# Altium project MB997.PrjPCB
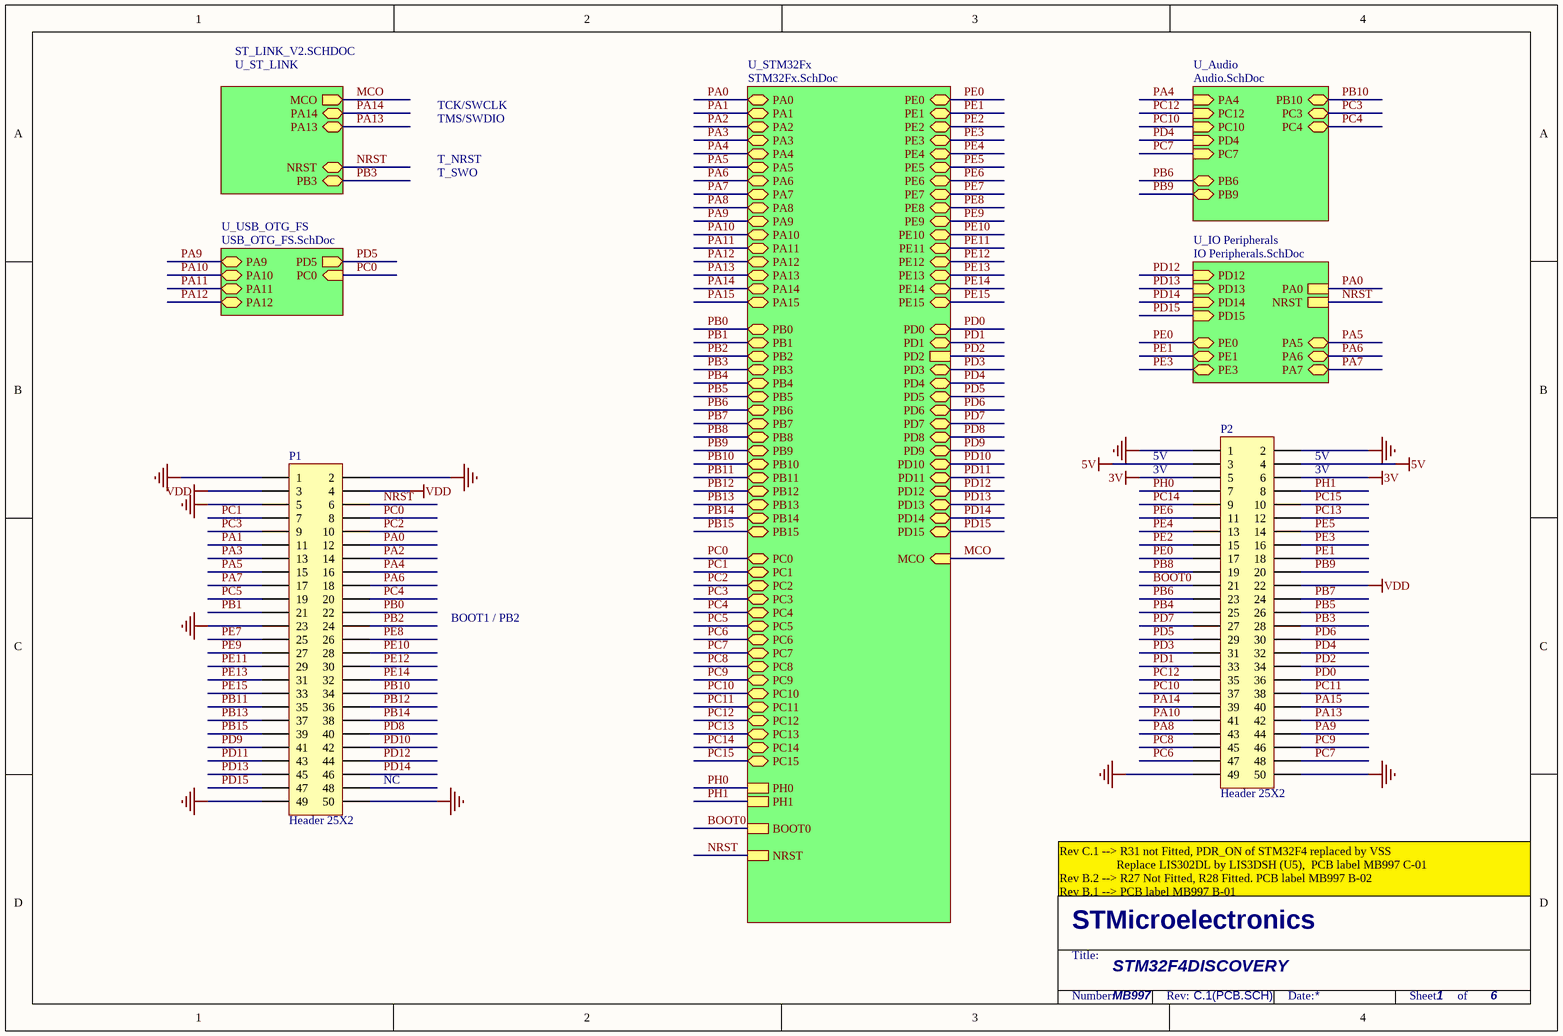
[diagram p0: MB997.SchDoc]
6 sheets, 187 parts. Net scope: hierarchical (ports join the sheet entries above them; power ports are global).
Sheets:
  MB997.SchDoc
    U_ST_LINK = ST_LINK_V2.SCHDOC
    U_Audio = Audio.SchDoc
    U_IO Peripherals = IO Peripherals.SchDoc
    U_STM32Fx = STM32Fx.SchDoc
    U_USB_OTG_FS = USB_OTG_FS.SchDoc

## Sheet MB997.SchDoc
size A4; DocumentNumber: 1; Revision: C.1(PCB.SCH); SheetNumber: 1; SheetTotal: 6; PageSetup: Record=PageOptions|CenterHorizontal=True|CenterVertical=True|PrintScale=1.00|XCorrection=1.00|YCorrection=1.00|PrintKind=1|BorderSize=5000000|LeftOffset=0|BottomOffset=0|Orientation=2|PaperLength=1000|PaperWidth=1000|Scale=100|PaperSource=15|PrintQuality=1200|MediaType=1|DitherType=10|PaperKind=A4|PrintScaleMode=1

### Parts
P1  Header 25X2  [HDR2X25]
P2  Header 25X2  [HDR2X25]

### Sub-sheets
U_Audio = Audio.SchDoc: PA4 (in), PC12 (in), PC10 (in), PB6 (bidir), PB9 (bidir), PD4 (in), PC7 (in), PC3, PB10, PC4
U_IO Peripherals = IO Peripherals.SchDoc: PA0, NRST, PD12 (in), PE0, PD13 (in), PD14 (in), PD15 (in), PE1, PA5 (bidir), PA7 (bidir), PE3, PA6 (bidir)
U_ST_LINK = ST_LINK_V2.SCHDOC: PA13, PA14, NRST, PB3, MCO (out)
U_STM32Fx = STM32Fx.SchDoc: PA13 (bidir), PA14 (bidir), PA15 (bidir), PA12 (bidir), PA0 (bidir), PA1 (bidir), PA2 (bidir), PA3 (bidir), PA4 (bidir), PA5 (bidir), PA6 (bidir), PA7 (bidir), PA8 (bidir), PA9 (bidir), PA10 (bidir), PA11 (bidir), PB12 (bidir), PB0 (bidir), PB1 (bidir), PB2 (bidir), PB3 (bidir), PB4 (bidir), PB5 (bidir), PB6 (bidir), PB7 (bidir), PB8 (bidir), PB9 (bidir), PB10 (bidir), PB11 (bidir), PB13 (bidir), PB14 (bidir), PB15 (bidir), PC3 (bidir), PC15 (bidir), PC14 (bidir), PC13 (bidir), PC12 (bidir), PC11 (bidir), PC10 (bidir), PC9 (bidir), PC8 (bidir), PC7 (bidir), PC6 (bidir), PC5 (bidir), PC4 (bidir), PC2 (bidir), PC1 (bidir), PC0 (bidir), PD2, BOOT0, PH1, PH0, NRST, MCO (in), PE0, PE1, PE2, PE3, PE4, PE5, PE6, PE7, PE8, PE9, PE10, PE11, PE12, PE13, PE14, PE15, PD0, PD1, PD3, PD4, PD5, PD6, PD7, PD8, PD9, PD10, PD11, PD12, PD13, PD14, PD15
U_USB_OTG_FS = USB_OTG_FS.SchDoc: PD5 (out), PA11 (bidir), PA12 (bidir), PC0 (in), PA10 (bidir), PA9 (bidir)

### Nets
3V: P2.5 P2.6
5V: P2.3 P2.4
GND: P1.1 P1.2 P1.5 P1.23 P1.49 P1.50 P2.1 P2.2 P2.49 P2.50
VDD: P1.3 P1.4 P2.22
BOOT0: P2.21 ; sheet U_STM32Fx/BOOT0
MCO: sheet U_ST_LINK/MCO, sheet U_STM32Fx/MCO
NRST: P1.6 ; sheet U_ST_LINK/NRST, sheet U_IO Peripherals/NRST, sheet U_STM32Fx/NRST
PA0: P1.12 ; sheet U_IO Peripherals/PA0, sheet U_STM32Fx/PA0
PA1: P1.11 ; sheet U_STM32Fx/PA1
PA2: P1.14 ; sheet U_STM32Fx/PA2
PA3: P1.13 ; sheet U_STM32Fx/PA3
PA4: P1.16 ; sheet U_Audio/PA4, sheet U_STM32Fx/PA4
PA5: P1.15 ; sheet U_IO Peripherals/PA5, sheet U_STM32Fx/PA5
PA6: P1.18 ; sheet U_IO Peripherals/PA6, sheet U_STM32Fx/PA6
PA7: P1.17 ; sheet U_IO Peripherals/PA7, sheet U_STM32Fx/PA7
PA8: P2.43 ; sheet U_STM32Fx/PA8
PA9: P2.44 ; sheet U_STM32Fx/PA9, sheet U_USB_OTG_FS/PA9
PA10: P2.41 ; sheet U_STM32Fx/PA10, sheet U_USB_OTG_FS/PA10
PA11: sheet U_STM32Fx/PA11, sheet U_USB_OTG_FS/PA11
PA12: sheet U_STM32Fx/PA12, sheet U_USB_OTG_FS/PA12
PA13: P2.42 ; sheet U_ST_LINK/PA13, sheet U_STM32Fx/PA13
PA14: P2.39 ; sheet U_ST_LINK/PA14, sheet U_STM32Fx/PA14
PA15: P2.40 ; sheet U_STM32Fx/PA15
PB0: P1.22 ; sheet U_STM32Fx/PB0
PB1: P1.21 ; sheet U_STM32Fx/PB1
PB2: P1.24 ; sheet U_STM32Fx/PB2
PB3: P2.28 ; sheet U_ST_LINK/PB3, sheet U_STM32Fx/PB3
PB4: P2.25 ; sheet U_STM32Fx/PB4
PB5: P2.26 ; sheet U_STM32Fx/PB5
PB6: P2.23 ; sheet U_Audio/PB6, sheet U_STM32Fx/PB6
PB7: P2.24 ; sheet U_STM32Fx/PB7
PB8: P2.19 ; sheet U_STM32Fx/PB8
PB9: P2.20 ; sheet U_Audio/PB9, sheet U_STM32Fx/PB9
PB10: P1.34 ; sheet U_Audio/PB10, sheet U_STM32Fx/PB10
PB11: P1.35 ; sheet U_STM32Fx/PB11
PB12: P1.36 ; sheet U_STM32Fx/PB12
PB13: P1.37 ; sheet U_STM32Fx/PB13
PB14: P1.38 ; sheet U_STM32Fx/PB14
PB15: P1.39 ; sheet U_STM32Fx/PB15
PC0: P1.8 ; sheet U_STM32Fx/PC0, sheet U_USB_OTG_FS/PC0
PC1: P1.7 ; sheet U_STM32Fx/PC1
PC2: P1.10 ; sheet U_STM32Fx/PC2
PC3: P1.9 ; sheet U_Audio/PC3, sheet U_STM32Fx/PC3
PC4: P1.20 ; sheet U_Audio/PC4, sheet U_STM32Fx/PC4
PC5: P1.19 ; sheet U_STM32Fx/PC5
PC6: P2.47 ; sheet U_STM32Fx/PC6
PC7: P2.48 ; sheet U_Audio/PC7, sheet U_STM32Fx/PC7
PC8: P2.45 ; sheet U_STM32Fx/PC8
PC9: P2.46 ; sheet U_STM32Fx/PC9
PC10: P2.37 ; sheet U_Audio/PC10, sheet U_STM32Fx/PC10
PC11: P2.38 ; sheet U_STM32Fx/PC11
PC12: P2.35 ; sheet U_Audio/PC12, sheet U_STM32Fx/PC12
PC13: P2.12 ; sheet U_STM32Fx/PC13
PC14: P2.9 ; sheet U_STM32Fx/PC14
PC15: P2.10 ; sheet U_STM32Fx/PC15
PD0: P2.36 ; sheet U_STM32Fx/PD0
PD1: P2.33 ; sheet U_STM32Fx/PD1
PD2: P2.34 ; sheet U_STM32Fx/PD2
PD3: P2.31 ; sheet U_STM32Fx/PD3
PD4: P2.32 ; sheet U_Audio/PD4, sheet U_STM32Fx/PD4
PD5: P2.29 ; sheet U_STM32Fx/PD5, sheet U_USB_OTG_FS/PD5
PD6: P2.30 ; sheet U_STM32Fx/PD6
PD7: P2.27 ; sheet U_STM32Fx/PD7
PD8: P1.40 ; sheet U_STM32Fx/PD8
PD9: P1.41 ; sheet U_STM32Fx/PD9
PD10: P1.42 ; sheet U_STM32Fx/PD10
PD11: P1.43 ; sheet U_STM32Fx/PD11
PD12: P1.44 ; sheet U_IO Peripherals/PD12, sheet U_STM32Fx/PD12
PD13: P1.45 ; sheet U_IO Peripherals/PD13, sheet U_STM32Fx/PD13
PD14: P1.46 ; sheet U_IO Peripherals/PD14, sheet U_STM32Fx/PD14
PD15: P1.47 ; sheet U_IO Peripherals/PD15, sheet U_STM32Fx/PD15
PE0: P2.17 ; sheet U_IO Peripherals/PE0, sheet U_STM32Fx/PE0
PE1: P2.18 ; sheet U_IO Peripherals/PE1, sheet U_STM32Fx/PE1
PE2: P2.15 ; sheet U_STM32Fx/PE2
PE3: P2.16 ; sheet U_IO Peripherals/PE3, sheet U_STM32Fx/PE3
PE4: P2.13 ; sheet U_STM32Fx/PE4
PE5: P2.14 ; sheet U_STM32Fx/PE5
PE6: P2.11 ; sheet U_STM32Fx/PE6
PE7: P1.25 ; sheet U_STM32Fx/PE7
PE8: P1.26 ; sheet U_STM32Fx/PE8
PE9: P1.27 ; sheet U_STM32Fx/PE9
PE10: P1.28 ; sheet U_STM32Fx/PE10
PE11: P1.29 ; sheet U_STM32Fx/PE11
PE12: P1.30 ; sheet U_STM32Fx/PE12
PE13: P1.31 ; sheet U_STM32Fx/PE13
PE14: P1.32 ; sheet U_STM32Fx/PE14
PE15: P1.33 ; sheet U_STM32Fx/PE15
PH0: P2.7 ; sheet U_STM32Fx/PH0
PH1: P2.8 ; sheet U_STM32Fx/PH1

Not connected (* = marked no-connect by the designer): P1 48

### Notes on the sheet
- TCK/SWCLK
- TMS/SWDIO
- T_SWO
- T_NRST
- 5V
- 3V
- (near P2) 5V
- (near P2) 3V
- BOOT1 / PB2
- (near P1) NC
- Rev C.1 --> R31 not Fitted, PDR_ON of STM32F4 replaced by VSS
  Replace LIS302DL by LIS3DSH (U5),  PCB label MB997 C-01
  Rev B.2 --> R27 Not Fitted, R28 Fitted. PCB label MB997 B-02
  Rev B.1 --> PCB label MB997 B-01
- STM32F4DISCOVERY
- MB997
- 1
- STMicroelectronics
- Title:
- Number:
- Rev:
- Date:
- Sheet       of

### Library data of the parts
P1 P2 = Header 25X2: Header, 25-Pin, Dual row; LatestRevisionDate: 17-Jul-2002; LatestRevisionNote: Re-released for DXP Platform.; Publisher: Altium Limited

## Sheet ST_LINK_V2.SCHDOC
size A4; DocumentNumber: 2; Revision: C.1(PCB.SCH); SheetNumber: 2; SheetTotal: 6
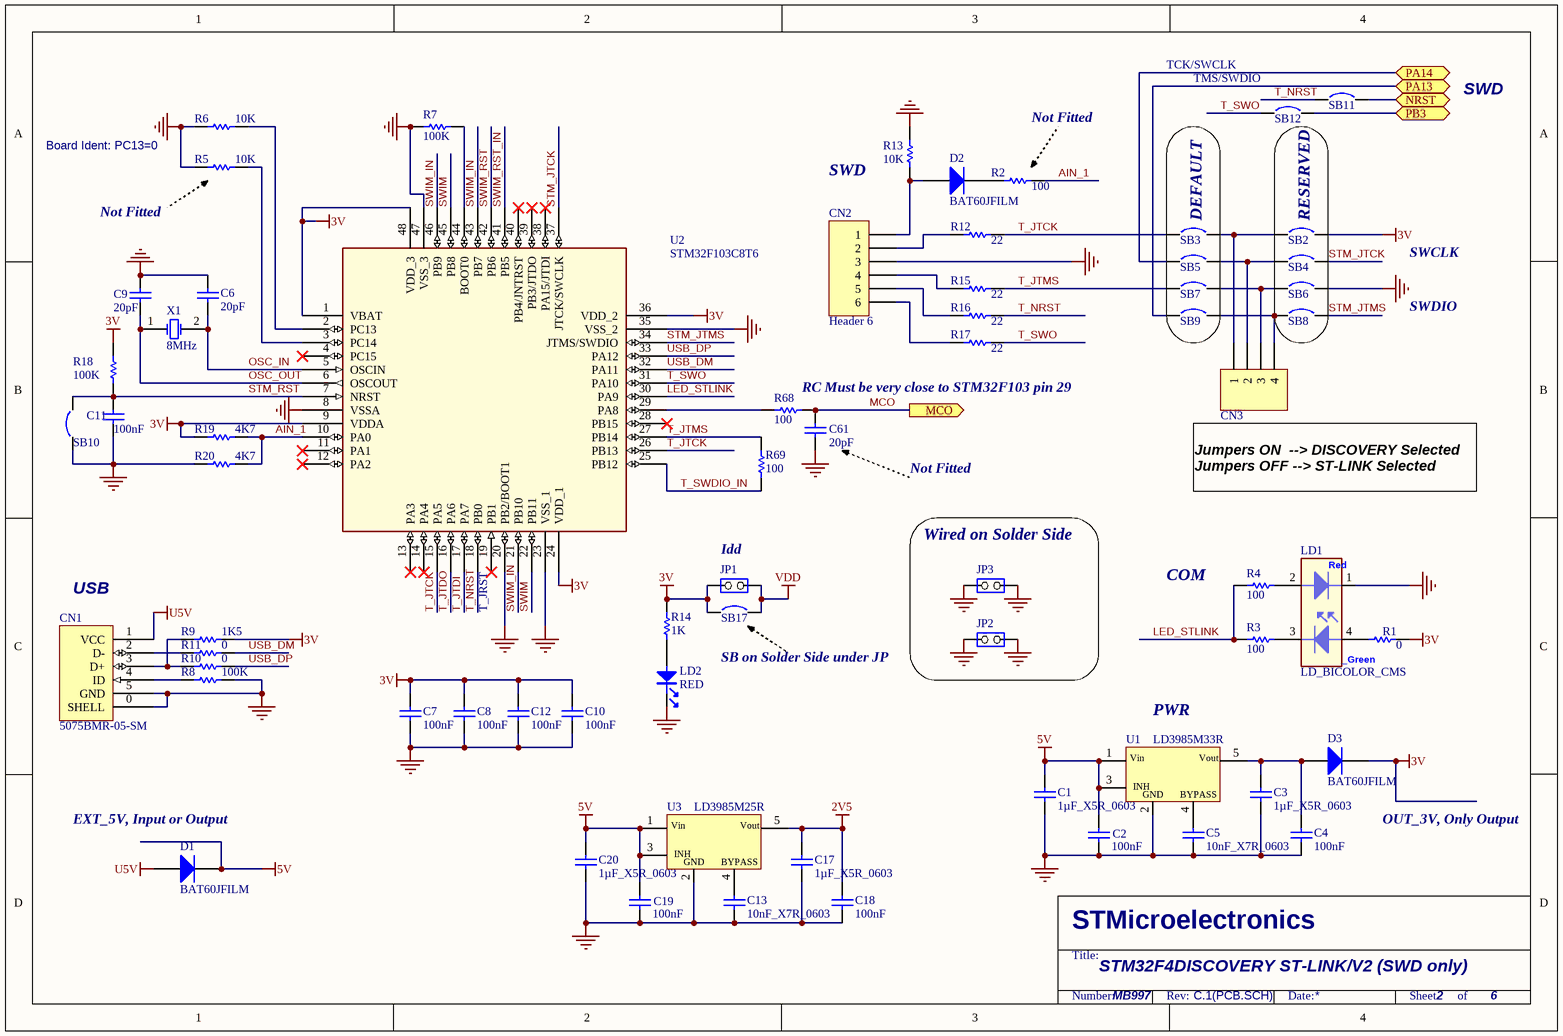
[diagram p1: ST_LINK_V2.SCHDOC]

### Parts
C1  1µF_X5R_0603  [0603C]
C2  100nF  [0603C]
C3  1µF_X5R_0603  [0603C]
C4  100nF  [0603C]
C5  10nF_X7R_0603  [0603C]
C6  20pF  [0402C]
C7  100nF  [0402C]
C8  100nF  [0402C]
C9  20pF  [0402C]
C10  100nF  [0402C]
C11  100nF  [0402C]
C12  100nF  [0402C]
C13  10nF_X7R_0603  [0603C]
C17  1µF_X5R_0603  [0603C]
C18  100nF  [0603C]
C19  100nF  [0603C]
C20  1µF_X5R_0603  [0603C]
C61  20pF  [0402C]
CN1  5075BMR-05-SM  [USB-MINI-B-SMD]
CN2  Header 6  [HDR1X6]
CN3  Header 4  [Header 4]  (value not drawn)
D1  BAT60JFILM  [SOD323/A]
D2  BAT60JFILM  [SOD323/A]
D3  BAT60JFILM  [SOD323/A]
JP1  (no value)  [SIP2/2.54]
JP2  (no value)  [SIP2/2.54]
JP3  (no value)  [SIP2/2.54]
LD1  LD_BICOLOR_CMS  [HSMF-A201]
LD2  RED  [0603D]
R1  0  [0402R]
R2  100  [0402R]
R3  100  [0402R]
R4  100  [0402R]
R5  10K  [0402R]
R6  10K  [0402R]
R7  100K  [0402R]
R8  100K  [0402R]
R9  1K5  [0402R]
R10  0  [0603R]
R11  0  [0603R]
R12  22  [0402R]
R13  10K  [0402R]
R14  1K  [0402R]
R15  22  [0402R]
R16  22  [0402R]
R17  22  [0402R]
R18  100K  [0402R]
R19  4K7  [0402R]
R20  4K7  [0402R]
R68  100  [0402R]
R69  100  [0402R]
SB2  Circuit Breaker  [JP2_SMD]  (value not drawn)
SB3  Circuit Breaker  [JP2_SMD]  (value not drawn)
SB4  Circuit Breaker  [JP2_SMD]  (value not drawn)
SB5  Circuit Breaker  [JP2_SMD]  (value not drawn)
SB6  Circuit Breaker  [JP2_SMD]  (value not drawn)
SB7  Circuit Breaker  [JP2_SMD]  (value not drawn)
SB8  Circuit Breaker  [JP2_SMD]  (value not drawn)
SB9  Circuit Breaker  [JP2_SMD]  (value not drawn)
SB10  Circuit Breaker  [JP2_SMD]  (value not drawn)
SB11  Circuit Breaker  [JP2_SMD]  (value not drawn)
SB12  Circuit Breaker  [JP2_SMD]  (value not drawn)
SB17  Circuit Breaker  [JP2_SMD]  (value not drawn)
U1  LD3985M33R  [SOT-23-5L]
U2  STM32F103C8T6  [QFP48 7X7]
U3  LD3985M25R  [SOT-23-5L]
X1  8MHz  [XTAL1]

### Blocks framed on the sheet
DEFAULT: SB3 SB5 SB7 SB9
RESERVED: SB2 SB4 SB6 SB8
Wired on Solder Side: JP2 JP3

### Ports
MCO (out), NRST, PA13, PA14, PB3

### Nets
2V5: C17.1 C18.2 U3.5(Vout)
3V: C7.2 C8.2 C10.2 C12.1 D3.2(K) JP1.1(COMMON) R1.2 R9.2 R14.2 R18.2 R19.1 SB2.2 SB17.1 U2.1(VBAT) U2.9(VDDA) U2.24(VDD_1) U2.36(VDD_2) U2.48(VDD_3)
5V: C1.2 C2.2 C19.2 C20.2 D1.2(K) U1.1(Vin) U1.3(CE) U3.1(Vin) U3.3(CE)
GND: C1.1 C2.1 C3.2 C4.1 C5.1 C6.1 C7.1 C8.1 C9.1 C10.1 C11.1 C12.2 C13.1 C17.2 C18.1 C19.1 C20.1 C61.2 CN1.0(SHELL) CN1.5(GND) CN2.3 JP2.1(COMMON) JP2.2(NO) JP3.1(COMMON) JP3.2(NO) LD1.1 LD2.2 R5.1 R6.1 R7.1 R8.2 R13.2 R20.1 SB6.2 SB10.1 U1.2(GND) U2.8(VSSA) U2.20(PB2/BOOT1) U2.23(VSS_1) U2.35(VSS_2) U2.47(VSS_3) U3.2(GND)
U5V: CN1.1(VCC) D1.1(A)
VDD: JP1.2(NO) SB17.2
AIN_1: R2.2 R19.2 R20.2 U2.10(PA0)
LED_STLINK: R3.1 R4.1 U2.30(PA9)
MCO: C61.1 R68.2 ; port MCO
NRST: SB11.2 ; port NRST
OSC_IN: C6.2 U2.5(OSCIN) X1.2(OSC2)
OSC_OUT: C9.2 U2.6(OSCOUT) X1.1(OSC1)
PA13: SB9.1 ; port PA13
PA14: SB5.1 ; port PA14
PB3: SB12.2 ; port PB3
STM_JTCK: SB4.2 U2.37(JTCK/SWCLK)
STM_JTMS: SB8.2 U2.34(JTMS/SWDIO)
STM_RST: C11.2 R18.1 SB10.2 U2.7(NRST)
SWIM: U2.22(PB11) U2.45(PB8)
SWIM_IN: U2.21(PB10) U2.43(PB7) U2.46(PB9)
SWIM_RST: U2.42(PB6)
SWIM_RST_IN: U2.41(PB5)
T_JTCK: R12.2 SB3.1 U2.15(PA5) U2.26(PB13)
T_JTDI: U2.17(PA7)
T_JTDO: U2.16(PA6)
T_JTMS: R15.2 R69.2 SB7.1 U2.27(PB14)
T_NRST: R16.2 SB11.1 U2.18(PB0)
T_SWDIO_IN: R69.1 U2.25(PB12)
T_SWO: R17.2 SB12.1 U2.31(PA10)
USB_DM: R11.2 U2.32(PA11)
USB_DP: R10.2 U2.33(PA12)
NetC3_1: C3.1 C4.2 D3.1(A) U1.5(Vout)
NetC5_2: C5.2 U1.4(BYPASS)
NetC13_2: C13.2 U3.4(BYPASS)
NetCN1_2: CN1.2(D-) R11.1
NetCN1_3: CN1.3(D+) R9.1 R10.1
NetCN1_4: CN1.4(ID) R8.1
NetCN2_1: CN2.1 D2.1(A) R13.1
NetCN2_2: CN2.2 R12.1
NetCN2_4: CN2.4 R15.1
NetCN2_5: CN2.5 R16.1
NetCN2_6: CN2.6 R17.1
NetCN3_1: CN3.1 SB2.1 SB3.2
NetCN3_2: CN3.2 SB4.1 SB5.2
NetCN3_3: CN3.3 SB6.1 SB7.2
NetCN3_4: CN3.4 SB8.1 SB9.2
NetD2_2: D2.2(K) R2.1
NetLD1_2: LD1.2 R4.2
NetLD1_3: LD1.3 R3.2
NetLD1_4: LD1.4 R1.1
NetLD2_1: LD2.1 R14.1
NetR5_2: R5.2 U2.3(PC14)
NetR6_2: R6.2 U2.2(PC13)
NetR7_2: R7.2 U2.44(BOOT0)
NetR68_1: R68.1 U2.29(PA8)

Not connected (* = marked no-connect by the designer): U2 4(PC15)* 11(PA1)* 12(PA2)* 13(PA3)* 14(PA4)* 19(PB1)* 28(PB15)* 38(PA15/JTDI)* 39(PB3/JTDO)* 40(PB4/JNTRST)*

### Notes on the sheet
- TCK/SWCLK
- (near SB12) TMS/SWDIO
- SWD
- Board Ident: PC13=0
- Not Fitted
- SWCLK
- SWDIO
- (near R68) RC Must be very close to STM32F103 pin 29
- Jumpers ON  --> DISCOVERY Selected
  Jumpers OFF --> ST-LINK Selected
- (near JP1) Idd
- COM
- (near CN1) USB
- (near U2) T_JRST
- SB on Solder Side under JP
- (near U1) PWR
- (near D1) EXT_5V, Input or Output
- OUT_3V, Only Output
- STM32F4DISCOVERY ST-LINK/V2 (SWD only)
- MB997
- STMicroelectronics
- Title:
- Number:
- Rev:
- Date:
- Sheet       of
- (in symbol LD3985M25R) INH
- (in symbol LD3985M33R) INH
- (in symbol LD_BICOLOR_CMS) Red; _Green

### Library data of the parts
C1 C3 C17 C20 = CAP SMD 0603  X5R 1µF 25V 10%: 0603  X5R 1µF; Rated voltage: 25V; Tolerance: 10%; Manufacturer: *; Manufacturer P/N: *; Order code Farnell: 1288202RL; Value: 1µF; Power: *; Technology: X5R; Temperature  Factor: *; Temperature Max: +125°C; Temperature Min: -55°C; STS Code: *
C2 C4 C6-C12 C18 C19 = Cap: Capacitor; Published: 8-Jun-2000; Revision: July-2002: Re-released for DXP Platform.; Publisher: Altium Limited
  C2 C4 C7 C8 C10-C12 C18 C19: Value: 100nF
  C6 C9: Value: 20pF
C5 C13 = CAP SMD 0603  X7R 10000PF 50V 10%: 0603  X7R 10NF; Order code RS: 2040779; Rated voltage: 50V; Tolerance: 10%; Order code Farnell: 7569548RL; Value: 10NF; Power: *; Technology: X7R; Temperature Factor: *; Temperature Min: -55°C; Temperature Max: +125°C; STS Code: *
C61 = Cap: Capacitor; Fitted: NO; Published: 8-Jun-2000; Publisher: Altium Limited; Value: 20pF; Revision: July-2002: Re-released for DXP Platform.
CN1 = USB-MINI-typeB connector
CN2 = Header 6: Header, 6-Pin; LatestRevisionDate: 17-Jul-2002; LatestRevisionNote: Re-released for DXP Platform.; Publisher: Altium Limited
CN3 = Header 4: Header, 4-Pin; Revision: 17-Jul-2002: Re-released for DXP Platform.; Publisher: Altium Limited
D1-D3 = BAT60JFILM: Manuf_1: STM; Code - JEDEC: DO-214-AB; Provided: ST; Published: 8-Jun-2000; Revision: July-2002: Re-released for DXP Platform.; Publisher: Altium Limited; Order: BAT60JFILM; Manuf_Part_1: BAT60JFILM
JP1-JP3 = JP2
LD1 = LD_BICOLOR_CMS: Bicolor Led; Manuf_Part_1: HSMF-A201-A00J1; Manuf_1: Avago Technologies; Ref St: xxxxxx; cap_dec: ----; Distrib: RADIOSPARES; support: ----
LD2 = PHOTO
R1 R3 R4 R6-R9 R12-R20 R68 R69 = res1: Resistor; Published: 8-Jun-2000; Revision: July-2002: Re-released for DXP Platform.; Publisher: Altium Limited
  R1: Value: 0
  R3 R4 R68 R69: Value: 100
  R6 R13: Value: 10K
  R7 R8 R18: Value: 100K
  R9: Value: 1K5
  R12 R15-R17: Value: 22
  R14: Value: 1K
  R19 R20: Value: 4K7
R2 R5 = res1: Resistor; Fitted: NO; Published: 8-Jun-2000; Revision: July-2002: Re-released for DXP Platform.; Publisher: Altium Limited
  R2: Value: 100
  R5: Value: 10K
R10 R11 = res1: Resistor; Value: 10; Published: 8-Jun-2000; Revision: July-2002: Re-released for DXP Platform.; Publisher: Altium Limited
SB2 SB4 SB6 SB8 SB11 SB12 SB17 = Circuit Breaker: Solder: YES; Published: 24-Mar-1999; Revision: July-2002: Re-released for DXP Platform.; Publisher: Altium Limited
SB3 SB5 SB7 SB9 SB10 = Circuit Breaker: Solder: NO; Published: 24-Mar-1999; Revision: July-2002: Re-released for DXP Platform.; Publisher: Altium Limited
U1 = LD3985M33R: Ultra low drop-low noise BiCMOS voltage, regulators low ESR capacitors compatible; Manuf_1: STM; Provided: ST; Manuf_Part_1: LD3985M33R
U2 = STM32F103C8T6: Manuf_1: STM; Ref St: 9175981; Provided: ST; Manuf_Part_1: STM32F103C8T6
U3 = LD3985M25R: Ultra low drop-low noise BiCMOS voltage, regulators low ESR capacitors compatible; Manuf_1: STM; Provided: ST; Manuf_Part_1: LD3985M25R
X1 = XTAL: Crystal Oscillator; Published: 8-Jun-2000; LatestRevisionDate: 17-Jul-2002; LatestRevisionNote: Re-released for DXP Platform.; PackageReference: R38; Publisher: Altium Limited

## Sheet Audio.SchDoc
size A4; DocumentNumber: 4; Revision: C.1(PCB.SCH); SheetNumber: 4; SheetTotal: 6
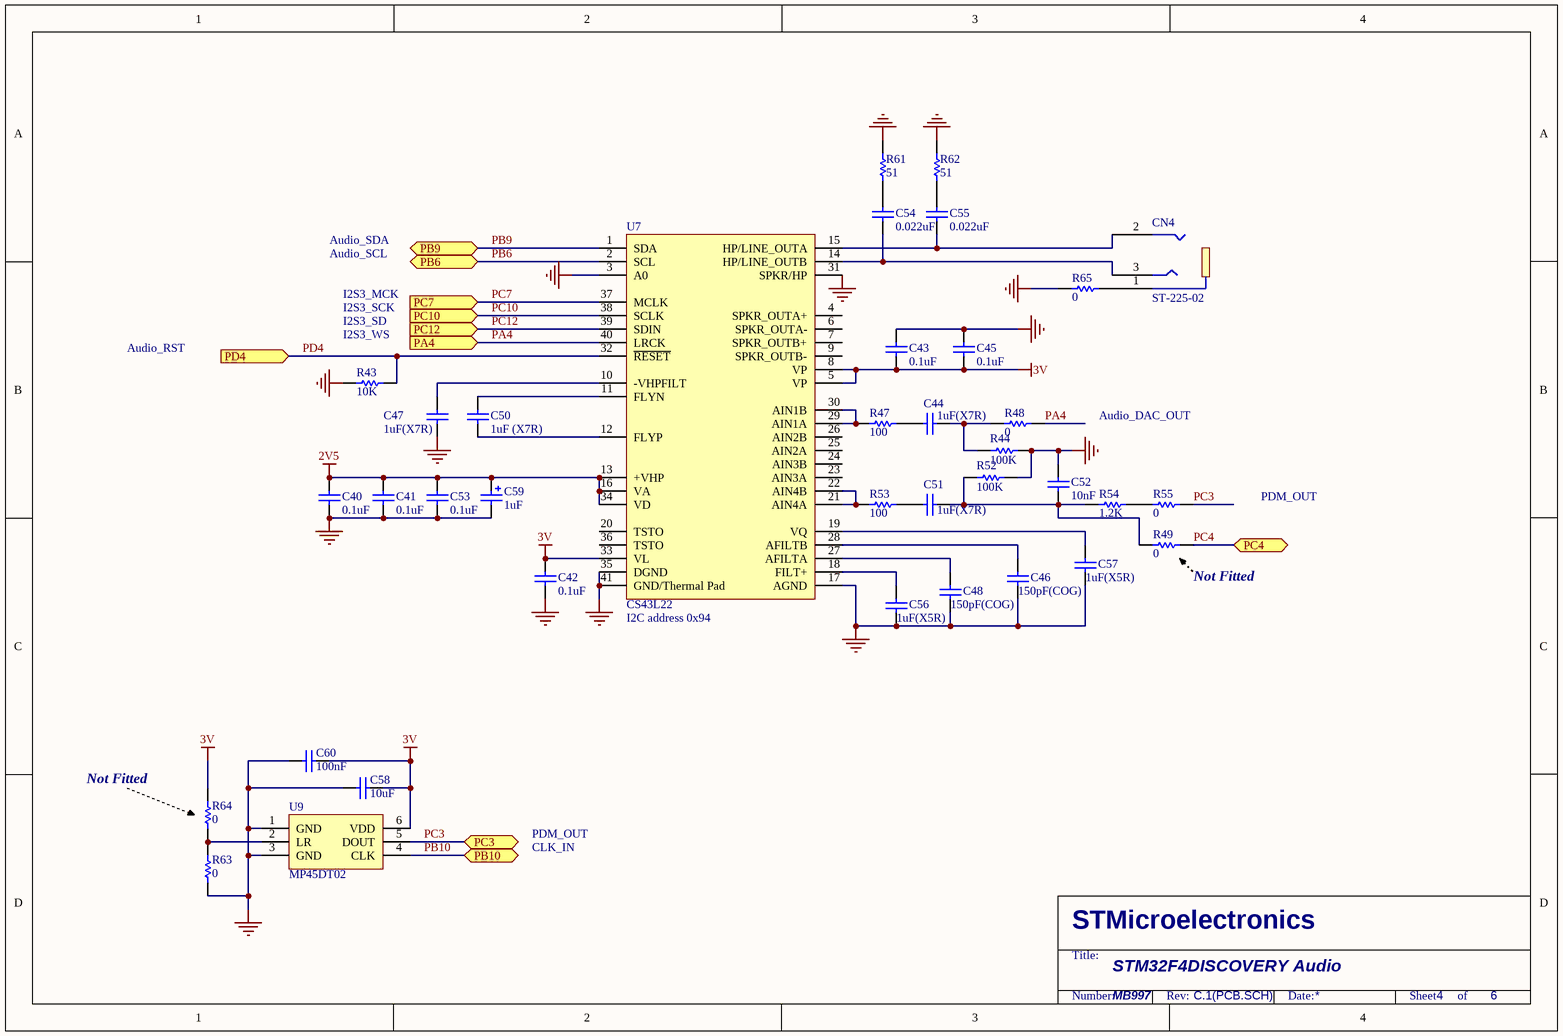
[diagram p2: Audio.SchDoc]

### Parts
C40  0.1uF  [0402C]
C41  0.1uF  [0402C]
C42  0.1uF  [0402C]
C43  0.1uF  [0402C]
C44  1uF(X7R)  [0603C]
C45  0.1uF  [0402C]
C46  150pF(COG)  [0603C]
C47  1uF(X7R)  [0603C]
C48  150pF(COG)  [0603C]
C50  1uF (X7R)  [0603C]
C51  1uF(X7R)  [0603C]
C52  10nF  [0603C]
C53  0.1uF  [0402C]
C54  0.022uF  [0603C]
C55  0.022uF  [0603C]
C56  1uF(X5R)  [0603C]
C57  1uF(X5R)  [0603C]
C58  10uF  [0603C]
C59  1uF  [TAN-A]
C60  100nF  [0603C]
CN4  ST-225-02  [Jack-ST-225]
R43  10K  [0402R]
R44  100K  [0402R]
R47  100  [0603R]
R48  0  [0402R]
R49  0  [0402R]
R52  100K  [0402R]
R53  100  [0603R]
R54  1.2K  [0603R]
R55  0  [0402R]
R61  51  [0603R]
R62  51  [0603R]
R63  0  [0402R]
R64  0  [0402R]
R65  0  [0402R]
U7  CS43L22  [QFN40]
U9  MP45DT02  [HLGA-4.72-3.76-6LD]

### Ports
PA4 (in), PB6 (bidir), PB9 (bidir), PB10, PC3, PC4, PC7 (in), PC10 (in), PC12 (in), PD4 (in)

### Nets
2V5: C40.2 C41.2 C53.2 C59.1 U7.13(+VHP) U7.16(VA) U7.34(VD)
3V: C42.2 C43.2 C45.2 C58.2 C60.2 R64.2 U7.5(VP) U7.8(VP) U7.33(VL) U9.6(VDD)
GND: C40.1 C41.1 C42.1 C43.1 C45.1 C46.1 C47.2 C48.1 C52.2 C53.1 C56.1 C57.1 C58.1 C59.2 C60.1 R43.2 R44.2 R52.2 R61.1 R62.1 R63.1 R65.2 U7.3(A0) U7.17(AGND) U7.31(SPKR/HP) U7.35(DGND) U7.41(GND/Thermal_Pad) U9.1(GND) U9.3(GND)
PA4: R48.1 U7.40(LRCK) ; port PA4
PB6: U7.2(SCL) ; port PB6
PB9: U7.1(SDA) ; port PB9
PB10: U9.4(CLK) ; port PB10
PC3: R55.1 U9.5(DOUT) ; port PC3
PC4: R49.1 ; port PC4
PC7: U7.37(MCLK) ; port PC7
PC10: U7.38(SCLK) ; port PC10
PC12: U7.39(SDIN) ; port PC12
PD4: R43.1 U7.32(~{RESET}) ; port PD4
NetC44_1: C44.1 R47.1
NetC44_2: C44.2 R44.1 R48.2
NetC46_2: C46.2 U7.28(AFILTB)
NetC47_1: C47.1 U7.10(-VHPFILT)
NetC48_2: C48.2 U7.27(AFILTA)
NetC50_1: C50.1 U7.12(FLYP)
NetC50_2: C50.2 U7.11(FLYN)
NetC51_1: C51.1 R53.1
NetC51_2: C51.2 C52.1 R49.2 R52.1 R54.1
NetC54_1: C54.1 R61.2
NetC54_2: C54.2 CN4.3 U7.14(HP/LINE_OUTB)
NetC55_1: C55.1 R62.2
NetC55_2: C55.2 CN4.2 U7.15(HP/LINE_OUTA)
NetC56_2: C56.2 U7.18(FILT+)
NetC57_2: C57.2 U7.19(VQ)
NetCN4_1: CN4.1 R65.1
NetR47_2: R47.2 U7.29(AIN1A) U7.30(AIN1B)
NetR53_2: R53.2 U7.21(AIN4A) U7.22(AIN4B)
NetR54_2: R54.2 R55.2
NetR63_2: R63.2 R64.1 U9.2(LR)

Not connected (* = marked no-connect by the designer): U7 4(SPKR_OUTA+) 6(SPKR_OUTA-) 7(SPKR_OUTB+) 9(SPKR_OUTB-) 20(TSTO) 23(AIN3A) 24(AIN3B) 25(AIN2A) 26(AIN2B) 36(TSTO)

### Notes on the sheet
- Audio_SDA
- Audio_SCL
- I2S3_MCK
- I2S3_SCK
- Audio_RST
- (near R43) I2S3_WS
- I2S3_SD
- Audio_DAC_OUT
- PDM_OUT
- (near R49) Not Fitted
- (near U7) I2C address 0x94
- (near R64) Not Fitted
- CLK_IN
- STM32F4DISCOVERY Audio
- MB997
- STMicroelectronics
- Title:
- Number:
- Rev:
- Date:
- Sheet       of

### Library data of the parts
C40-C48 C50-C58 = CAP: Capacitor; Value: 100nF; Published: 8-Jun-2000; Revision: July-2002: Re-released for DXP Platform.; Publisher: Altium Limited
C59 = Cap Pol1: Polarized Capacitor (Radial); Value: 47uF; Published: 8-Jun-2000; Revision: July-2002: Re-released for DXP Platform.; Publisher: Altium Limited
C60 = CAP: Capacitor; Published: 8-Jun-2000; Revision: July-2002: Re-released for DXP Platform.; Publisher: Altium Limited; Value: 100nF
CN4 = ST-225-02: Connector Jack 35mm; Manuf_1: XIEJIA Electronics; Order: ST-225-02; Manuf_Part_1: ST-225-02
R43 R44 R47 R48 R52 R53 R55 R61 R62 R65 = res1: Resistor; Value: 1K; Published: 8-Jun-2000; Revision: July-2002: Re-released for DXP Platform.; Publisher: Altium Limited
R49 = res1: Resistor; Value: 1K; Fitted: NO; Published: 8-Jun-2000; Revision: July-2002: Re-released for DXP Platform.; Publisher: Altium Limited
R54 R63 = res1: Resistor; Published: 8-Jun-2000; Revision: July-2002: Re-released for DXP Platform.; Publisher: Altium Limited
  R54: Value: 1.2K
  R63: Value: 0
R64 = res1: Resistor; Fitted: NO; Published: 8-Jun-2000; Revision: July-2002: Re-released for DXP Platform.; Publisher: Altium Limited; Value: 0
U7 = CS43L22: Low Power, Stereo DAC w/Headphone & Speaker Amps; Order: *; Manuf_1: *; Manuf_Part_1: *; Fooprint: *
U9 = MP45DT02: MEMS audio sensor, omnidirectional digital microphone; Manuf_1: STM; Provided: ST; Ref St: 9188006; Manuf_Part_1: MP45DT02; Order: *

## Sheet IO Peripherals.SchDoc
size A4; DocumentNumber: 6; Revision: C.1(PCB.SCH); SheetNumber: 6; SheetTotal: 6
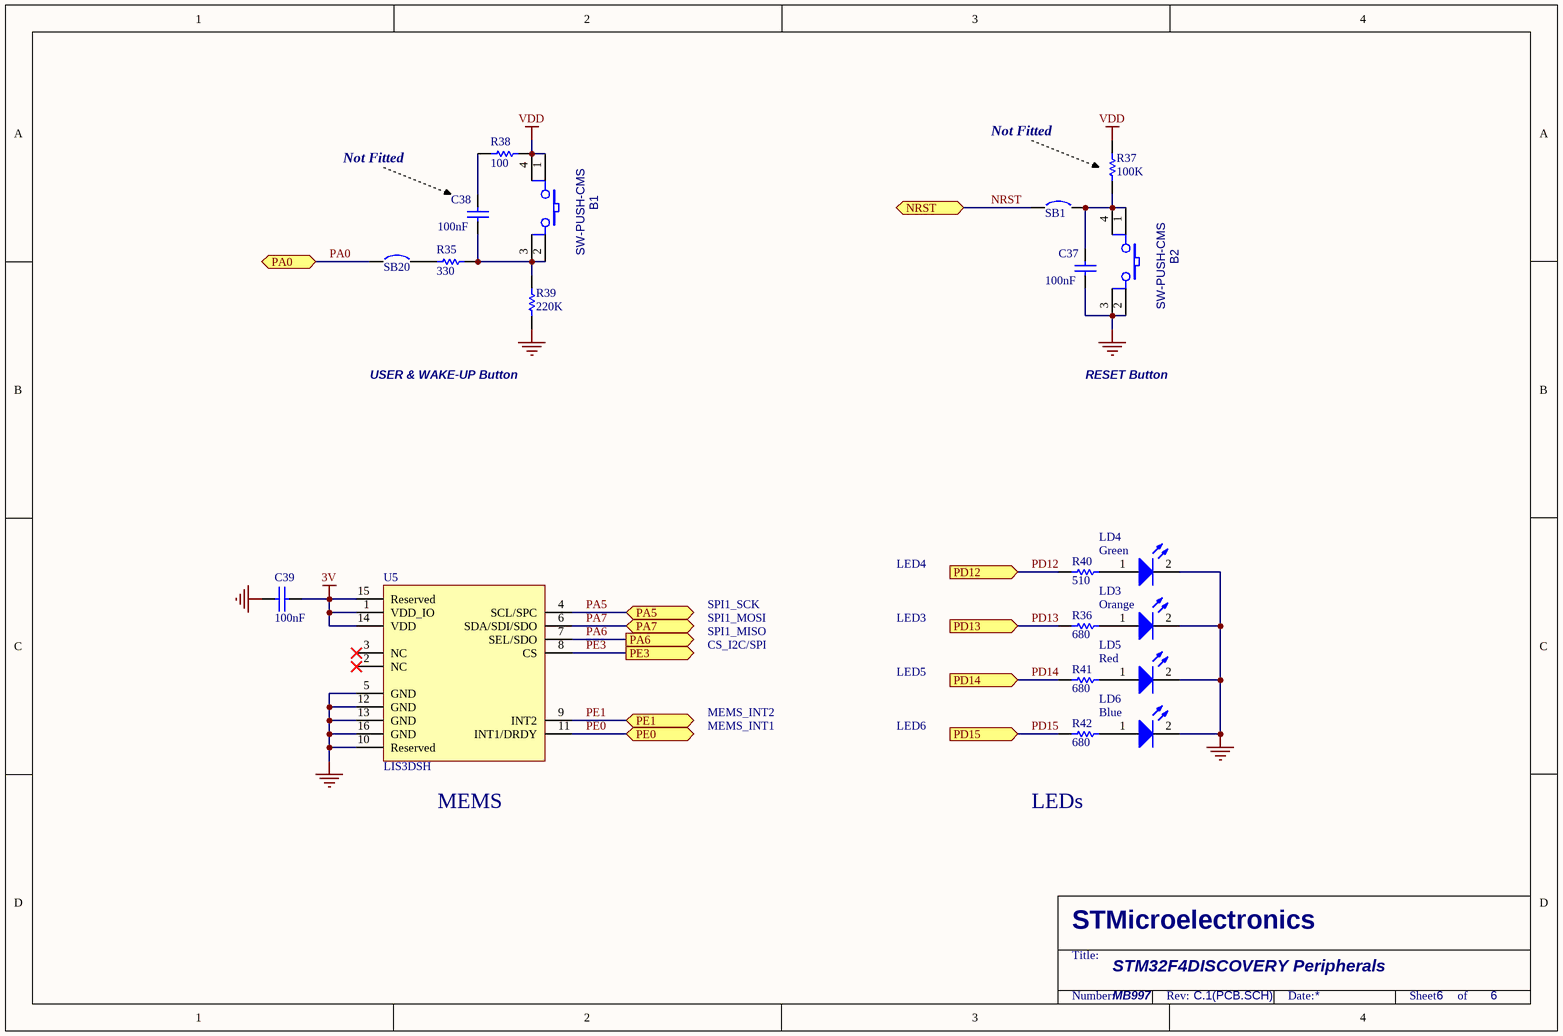
[diagram p3: IO Peripherals.SchDoc]

### Parts
B1  SW-PUSH-CMS  [BP1CMS]
B2  SW-PUSH-CMS  [BP1CMS]
C37  100nF  [0603C]
C38  100nF  [0603C]
C39  100nF  [0402C]
LD3  Orange  [0603D]
LD4  Green  [0603D]
LD5  Red  [0603D]
LD6  Blue  [0603D]
R35  330  [0402R]
R36  680  [0603R]
R37  100K  [0402R]
R38  100  [0402R]
R39  220K  [0603R]
R40  510  [0603R]
R41  680  [0603R]
R42  680  [0603R]
SB1  Circuit Breaker  [JP2_SMD]  (value not drawn)
SB20  Circuit Breaker  [JP2_SMD]  (value not drawn)
U5  LIS3DSH  [LGA16(3*3)]

### Ports
NRST, PA0, PA5 (bidir), PA6 (out), PA7 (bidir), PD12 (in), PD13 (in), PD14 (in), PD15 (in), PE0, PE1, PE3 (out)

### Nets
3V: C39.2 U5.1(VDD_IO) U5.14(VDD) U5.15(Reserved)
GND: B2.2 B2.3 C37.1 C39.1 LD3.2(K) LD4.2(K) LD5.2(K) LD6.2(K) R39.1 U5.5(GND) U5.10(Reserved) U5.12(GND) U5.13(GND) U5.16(GND)
VDD: B1.1 B1.4 R37.2 R38.2
NRST: SB1.1 ; port NRST
PA0: SB20.1 ; port PA0
PA5: U5.4(SCL/SPC) ; port PA5
PA6: U5.7(SEL/SDO) ; port PA6
PA7: U5.6(SDA/SDI/SDO) ; port PA7
PD12: R40.2 ; port PD12
PD13: R36.2 ; port PD13
PD14: R41.2 ; port PD14
PD15: R42.2 ; port PD15
PE0: U5.11(INT1/DRDY) ; port PE0
PE1: U5.9(INT2) ; port PE1
PE3: U5.8(CS) ; port PE3
NetB1_2: B1.2 B1.3 C38.1 R35.2 R39.2
NetB2_1: B2.1 B2.4 C37.2 R37.1 SB1.2
NetC38_2: C38.2 R38.1
NetLD3_1: LD3.1(A) R36.1
NetLD4_1: LD4.1(A) R40.1
NetLD5_1: LD5.1(A) R41.1
NetLD6_1: LD6.1(A) R42.1
NetR35_1: R35.1 SB20.2

Not connected (* = marked no-connect by the designer): U5 2(NC)* 3(NC)*

### Notes on the sheet
- Not Fitted
- USER & WAKE-UP Button
- RESET Button
- LED4
- SPI1_MOSI
- SPI1_SCK
- SPI1_MISO
- CS_I2C/SPI
- LED3
- MEMS_INT2
- LED5
- MEMS_INT1
- LED6
- (near U5) MEMS
- LEDs
- STM32F4DISCOVERY Peripherals
- MB997
- STMicroelectronics
- Title:
- Number:
- Rev:
- Date:
- Sheet       of

### Library data of the parts
B1 B2 = SW-PUSH-CMS: Non-Open Push-Button 0.1A 24V; Manuf_1: FARNELL; Manuf_Part_1: 535-930; Ref St: 9180120; cap_dec: ---
C37 C39 = CAP: Capacitor
  C37: Published: 8-Jun-2000; Revision: July-2002: Re-released for DXP Platform.; Publisher: Altium Limited; Value: 100nF
C38 = CAP: Capacitor; Fitted: NO; Published: 8-Jun-2000; Revision: July-2002: Re-released for DXP Platform.; Publisher: Altium Limited; Value: 100nF
LD3-LD6 = LED2: Typical RED, GREEN, YELLOW, AMBER GaAs LED; Published: 8-Jun-2000; Revision: July-2002: Re-released for DXP Platform.; Publisher: Altium Limited
R35 = res1: Resistor; Published: 8-Jun-2000; Revision: July-2002: Re-released for DXP Platform.; Publisher: Altium Limited; Value: 330
R36 R40-R42 = Res1: Resistor; Value: 1K; Published: 8-Jun-2000; Revision: July-2002: Re-released for DXP Platform.; Publisher: Altium Limited
R37 = res1: Resistor; Fitted: NO; Published: 8-Jun-2000; Revision: July-2002: Re-released for DXP Platform.; Publisher: Altium Limited; Value: 100K
R38 = res1: Resistor; Value: 330; Published: 8-Jun-2000; Revision: July-2002: Re-released for DXP Platform.; Publisher: Altium Limited
R39 = res1: Resistor; Value: 10K; Published: 8-Jun-2000; Revision: July-2002: Re-released for DXP Platform.; Publisher: Altium Limited
SB1 SB20 = Circuit Breaker: Solder: YES; Published: 24-Mar-1999; Revision: July-2002: Re-released for DXP Platform.; Publisher: Altium Limited
U5 = LIS3DSH: MEMS motion sensor 3-axis - ±2g/±4g/±6g/±8g/±16g digital output accelerometer; Manuf_1: STM; Manuf_Part_1: LIS3DSHTR; Provided: ST; Description: MEMS motion sensor 3-axis - ±2g to ±16g digital output accelerometer; ref St: to be created; Distrib: STM; Order: LIS3DSHTR

## Sheet STM32Fx.SchDoc
size A4; DocumentNumber: 3; Revision: C.1(PCB.SCH); SheetNumber: 3; SheetTotal: 6
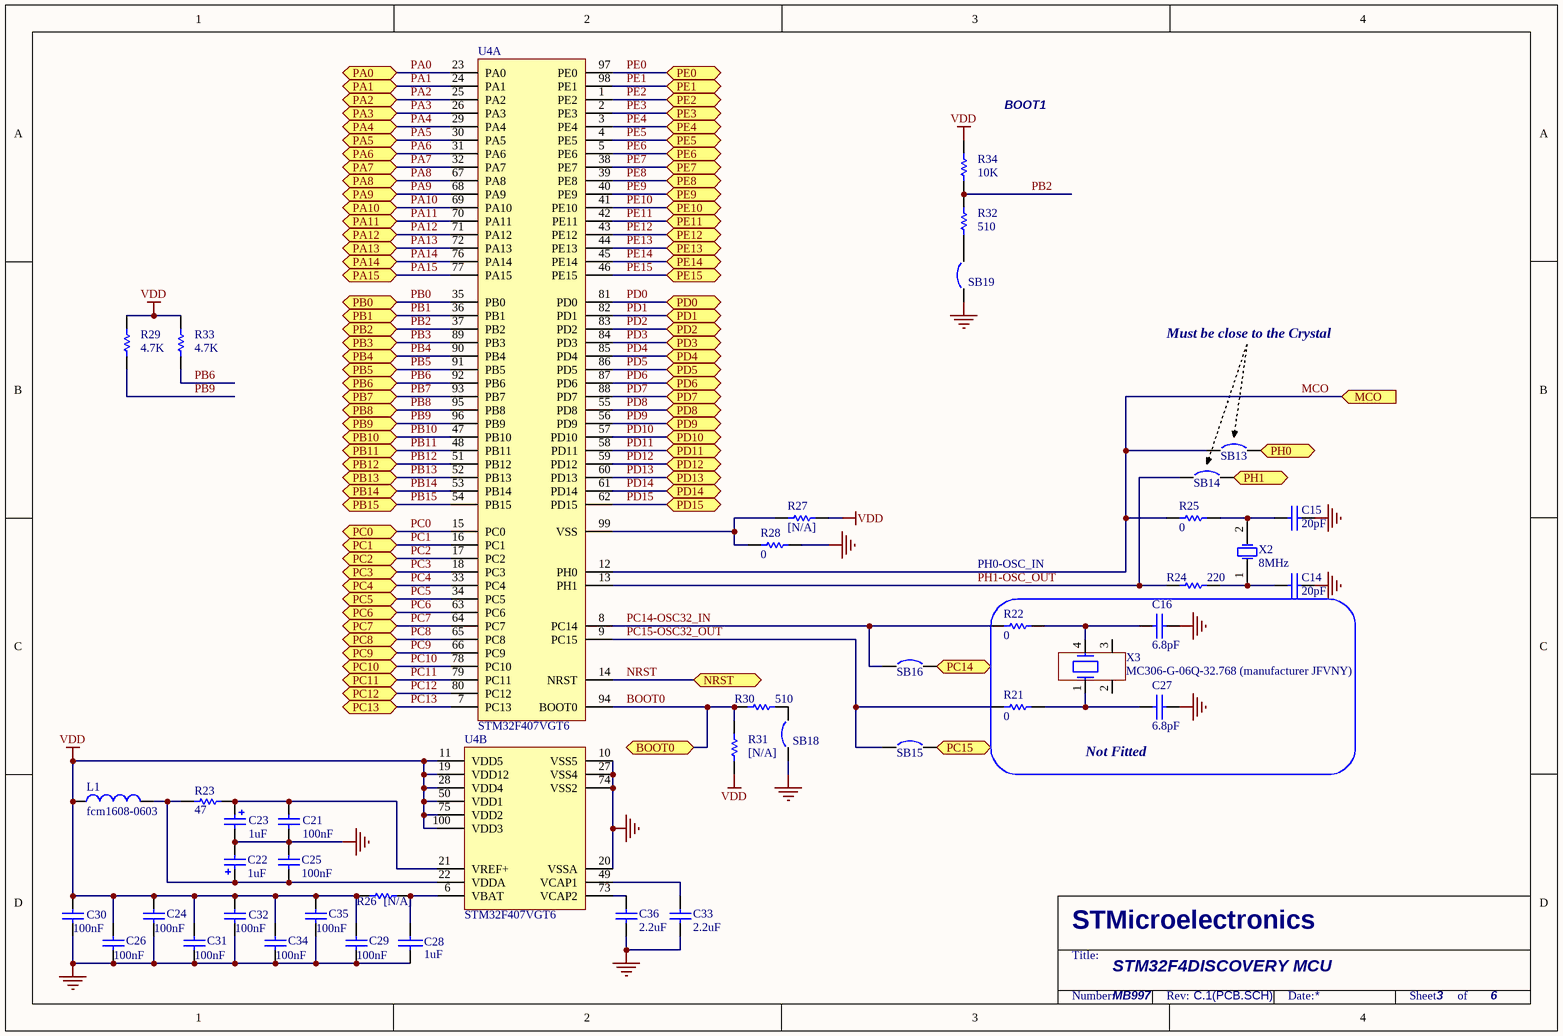
[diagram p4: STM32Fx.SchDoc]

### Parts
C14  20pF  [0603C]
C15  20pF  [0603C]
C16  6.8pF  [0603C]
C21  100nF  [0603C]
C22  1uF  [CASE-AA]
C23  1uF  [CASE-AA]
C24  100nF  [0603C]
C25  100nF  [0603C]
C26  100nF  [0603C]
C27  6.8pF  [0603C]
C28  1uF  [0603C]
C29  100nF  [0603C]
C30  100nF  [0603C]
C31  100nF  [0603C]
C32  100nF  [0603C]
C33  2.2uF  [CASE-A]
C34  100nF  [0603C]
C35  100nF  [0603C]
C36  2.2uF  [CASE-A]
L1  fcm1608-0603  [0603L]
R21  0  [0603R]
R22  0  [0603R]
R23  47  [0603R]
R24  220  [0603R]
R25  0  [0603R]
R26  [N/A]  [0603R]
R27  [N/A]  [0603R]
R28  0  [0603R]
R29  4.7K  [0402R]
R30  510  [0603R]
R31  [N/A]  [0402R]
R32  510  [0603R]
R33  4.7K  [0402R]
R34  10K  [0402R]
SB13  Circuit Breaker  [JP2_SMD]  (value not drawn)
SB14  Circuit Breaker  [JP2_SMD]  (value not drawn)
SB15  Circuit Breaker  [JP2_SMD]  (value not drawn)
SB16  Circuit Breaker  [JP2_SMD]  (value not drawn)
SB18  Circuit Breaker  [JP2_SMD]  (value not drawn)
SB19  Circuit Breaker  [JP2_SMD]  (value not drawn)
U4  STM32F407VGT6  [TQFP100]  (parts A,B of 2)
X2  8MHz  [XTAL1]
X3  MC306-G-06Q-32.768 (manufacturer JFVNY)  [MC306-CRYSTAL]

### Blocks framed on the sheet
Not Fitted: C16 C27 R21 R22 X3

### Ports
BOOT0, MCO (in), NRST, PA0 (bidir), PA1 (bidir), PA2 (bidir), PA3 (bidir), PA4 (bidir), PA5 (bidir), PA6 (bidir), PA7 (bidir), PA8 (bidir), PA9 (bidir), PA10 (bidir), PA11 (bidir), PA12 (bidir), PA13 (bidir), PA14 (bidir), PA15 (bidir), PB0 (bidir), PB1 (bidir), PB2 (bidir), PB3 (bidir), PB4 (bidir), PB5 (bidir), PB6 (bidir), PB7 (bidir), PB8 (bidir), PB9 (bidir), PB10 (bidir), PB11 (bidir), PB12 (bidir), PB13 (bidir), PB14 (bidir), PB15 (bidir), PC0 (bidir), PC1 (bidir), PC2 (bidir), PC3 (bidir), PC4 (bidir), PC5 (bidir), PC6 (bidir), PC7 (bidir), PC8 (bidir), PC9 (bidir), PC10 (bidir), PC11 (bidir), PC12 (bidir), PC13 (bidir), PC14 (bidir), PC15 (bidir), PD0, PD1, PD2, PD3, PD4, PD5, PD6, PD7, PD8, PD9, PD10, PD11, PD12, PD13, PD14, PD15, PE0, PE1, PE2, PE3, PE4, PE5, PE6, PE7, PE8, PE9, PE10, PE11, PE12, PE13, PE14, PE15, PH0, PH1

### Nets
GND: C14.1 C15.1 C16.2 C21.1 C22.2 C23.2 C24.2 C25.1 C26.1 C27.2 C28.2 C29.1 C30.1 C31.1 C32.1 C33.2 C34.1 C35.2 C36.2 R28.2 SB18.1 SB19.1 U4.10(VSS5) U4.20(VSSA) U4.27(VSS4) U4.74(VSS2)
VDD: C24.1 C26.2 C29.2 C30.2 C31.2 C32.2 C34.2 C35.1 L1.1 R26.1 R27.2 R29.1 R31.2 R33.1 R34.1 U4.11(VDD5) U4.19(VDD12) U4.28(VDD4) U4.50(VDD1) U4.75(VDD2) U4.100(VDD3)
BOOT0: R30.2 R31.1 U4.94(BOOT0) ; port BOOT0
MCO: R25.1 SB13.1 U4.12(PH0) ; port MCO
NRST: U4.14(NRST) ; port NRST
PA0: U4.23(PA0) ; port PA0
PA1: U4.24(PA1) ; port PA1
PA2: U4.25(PA2) ; port PA2
PA3: U4.26(PA3) ; port PA3
PA4: U4.29(PA4) ; port PA4
PA5: U4.30(PA5) ; port PA5
PA6: U4.31(PA6) ; port PA6
PA7: U4.32(PA7) ; port PA7
PA8: U4.67(PA8) ; port PA8
PA9: U4.68(PA9) ; port PA9
PA10: U4.69(PA10) ; port PA10
PA11: U4.70(PA11) ; port PA11
PA12: U4.71(PA12) ; port PA12
PA13: U4.72(PA13) ; port PA13
PA14: U4.76(PA14) ; port PA14
PA15: U4.77(PA15) ; port PA15
PB0: U4.35(PB0) ; port PB0
PB1: U4.36(PB1) ; port PB1
PB2: R32.1 R34.2 U4.37(PB2) ; port PB2
PB3: U4.89(PB3) ; port PB3
PB4: U4.90(PB4) ; port PB4
PB5: U4.91(PB5) ; port PB5
PB6: R33.2 U4.92(PB6) ; port PB6
PB7: U4.93(PB7) ; port PB7
PB8: U4.95(PB8) ; port PB8
PB9: R29.2 U4.96(PB9) ; port PB9
PB10: U4.47(PB10) ; port PB10
PB11: U4.48(PB11) ; port PB11
PB12: U4.51(PB12) ; port PB12
PB13: U4.52(PB13) ; port PB13
PB14: U4.53(PB14) ; port PB14
PB15: U4.54(PB15) ; port PB15
PC0: U4.15(PC0) ; port PC0
PC1: U4.16(PC1) ; port PC1
PC2: U4.17(PC2) ; port PC2
PC3: U4.18(PC3) ; port PC3
PC4: U4.33(PC4) ; port PC4
PC5: U4.34(PC5) ; port PC5
PC6: U4.63(PC6) ; port PC6
PC7: U4.64(PC7) ; port PC7
PC8: U4.65(PC8) ; port PC8
PC9: U4.66(PC9) ; port PC9
PC10: U4.78(PC10) ; port PC10
PC11: U4.79(PC11) ; port PC11
PC12: U4.80(PC12) ; port PC12
PC13: U4.7(PC13) ; port PC13
PC14: SB16.2 ; port PC14
PC14-OSC32_IN: R22.1 SB16.1 U4.8(PC14)
PC15: SB15.2 ; port PC15
PC15-OSC32_OUT: R21.1 SB15.1 U4.9(PC15)
PD0: U4.81(PD0) ; port PD0
PD1: U4.82(PD1) ; port PD1
PD2: U4.83(PD2) ; port PD2
PD3: U4.84(PD3) ; port PD3
PD4: U4.85(PD4) ; port PD4
PD5: U4.86(PD5) ; port PD5
PD6: U4.87(PD6) ; port PD6
PD7: U4.88(PD7) ; port PD7
PD8: U4.55(PD8) ; port PD8
PD9: U4.56(PD9) ; port PD9
PD10: U4.57(PD10) ; port PD10
PD11: U4.58(PD11) ; port PD11
PD12: U4.59(PD12) ; port PD12
PD13: U4.60(PD13) ; port PD13
PD14: U4.61(PD14) ; port PD14
PD15: U4.62(PD15) ; port PD15
PE0: U4.97(PE0) ; port PE0
PE1: U4.98(PE1) ; port PE1
PE2: U4.1(PE2) ; port PE2
PE3: U4.2(PE3) ; port PE3
PE4: U4.3(PE4) ; port PE4
PE5: U4.4(PE5) ; port PE5
PE6: U4.5(PE6) ; port PE6
PE7: U4.38(PE7) ; port PE7
PE8: U4.39(PE8) ; port PE8
PE9: U4.40(PE9) ; port PE9
PE10: U4.41(PE10) ; port PE10
PE11: U4.42(PE11) ; port PE11
PE12: U4.43(PE12) ; port PE12
PE13: U4.44(PE13) ; port PE13
PE14: U4.45(PE14) ; port PE14
PE15: U4.46(PE15) ; port PE15
PH0: SB13.2 ; port PH0
PH1: SB14.2 ; port PH1
PH1-OSC_OUT: R24.2 SB14.1 U4.13(PH1)
NetC14_2: C14.2 R24.1 X2.1(OSC1)
NetC15_2: C15.2 R25.2 X2.2(OSC2)
NetC16_1: C16.1 R22.2 X3.4
NetC21_2: C21.2 C23.1 R23.1 U4.21(VREF+)
NetC22_1: C22.1 C25.2 L1.2 R23.2 U4.22(VDDA)
NetC27_1: C27.1 R21.2 X3.1
NetC28_1: C28.1 R26.2 U4.6(VBAT)
NetC33_1: C33.1 U4.49(VCAP1)
NetC36_1: C36.1 U4.73(VCAP2)
NetR27_1: R27.1 R28.1 U4.99(VSS)
NetR30_1: R30.1 SB18.2
NetR32_2: R32.2 SB19.2

Not connected (* = marked no-connect by the designer): X3 2 3

### Notes on the sheet
- BOOT1
- Must be close to the Crystal
- PH0-OSC_IN
- STM32F4DISCOVERY MCU
- MB997
- STMicroelectronics
- Title:
- Number:
- Rev:
- Date:
- Sheet       of

### Library data of the parts
C14 C15 C28 = CAP: Capacitor
  C14 C15: Value: 20pF
  C28: Value: 1uF
C16 C27 = CAP: Capacitor; Fitted: NO; Value: 6.8pF
C21 C24-C26 C29-C32 C34 C35 = Cap: Capacitor; Published: 8-Jun-2000; Revision: July-2002: Re-released for DXP Platform.; Publisher: Altium Limited; Value: 100nF
C22 C23 = Cap Pol1: Polarized Capacitor (Radial); Value: 10uF; Published: 8-Jun-2000; Revision: July-2002: Re-released for DXP Platform.; Publisher: Altium Limited
C33 C36 = Cap Low ESR: Low ESR Ceramic Capacitor (X7R); Order: CC1206KKX7R7BB225; Published: 8-Jun-2000; Revision: July-2002: Re-released for DXP Platform.; Publisher: Altium Limited; Value: 2.2uF; Distrib: www.yageo.com
L1 = Inductor: Value: 100uH; Published: 8-Jun-2000; Revision: July-2002: Re-released for DXP Platform.; Publisher: Altium Limited
R21 R22 R25 = Res1: Resistor; Fitted: NO; Published: 8-Jun-2000; Revision: July-2002: Re-released for DXP Platform.; Publisher: Altium Limited; Value: 0
R23 = Res1: Resistor; Value: 1K; Published: 8-Jun-2000; Revision: July-2002: Re-released for DXP Platform.; Publisher: Altium Limited
R24 R28 R30 = Res1: Resistor; Published: 8-Jun-2000; Revision: July-2002: Re-released for DXP Platform.; Publisher: Altium Limited
  R24: Value: 220
  R28: Value: 0
  R30: Value: 510
R26 = res1: Resistor; Value: 0; Fitted: NO; Published: 8-Jun-2000; Revision: July-2002: Re-released for DXP Platform.; Publisher: Altium Limited
R27 = Res1: Resistor; Value: 0; Fitted: NO; Published: 8-Jun-2000; Revision: July-2002: Re-released for DXP Platform.; Publisher: Altium Limited
R29 R33 = res1: Resistor; Value: 10K; Published: 8-Jun-2000; Revision: July-2002: Re-released for DXP Platform.; Publisher: Altium Limited
R31 = res1: Resistor; Value: 10K; Fitted: NO; Published: 8-Jun-2000; Revision: July-2002: Re-released for DXP Platform.; Publisher: Altium Limited
R32 R34 = res1: Resistor; Published: 8-Jun-2000; Revision: July-2002: Re-released for DXP Platform.; Publisher: Altium Limited
  R32: Value: 510
  R34: Value: 10K
SB13 SB15 SB16 SB19 = Circuit Breaker: Solder: NO; Published: 24-Mar-1999; Revision: July-2002: Re-released for DXP Platform.; Publisher: Altium Limited
SB14 SB18 = Circuit Breaker: Solder: YES; Published: 24-Mar-1999; Revision: July-2002: Re-released for DXP Platform.; Publisher: Altium Limited
U4 = STM32F407VGT6: STM32 Manta (STM32F407VGT6); Manuf_1: STM; Provided: ST; Ref St: 9175122; ECCN_US/EU: 3A991A2/NEC; Manuf_Part_1: STM32F407VGT6; Distrib: ST; Footprint: QFP100
X2 = XTAL: Crystal Oscillator; Published: 8-Jun-2000; LatestRevisionDate: 17-Jul-2002; LatestRevisionNote: Re-released for DXP Platform.; PackageReference: R38; Publisher: Altium Limited
X3 = MC306: Fitted: NO

## Sheet USB_OTG_FS.SchDoc
size A4; DocumentNumber: 5; Revision: C.1(PCB.SCH); SheetNumber: 5; SheetTotal: 6
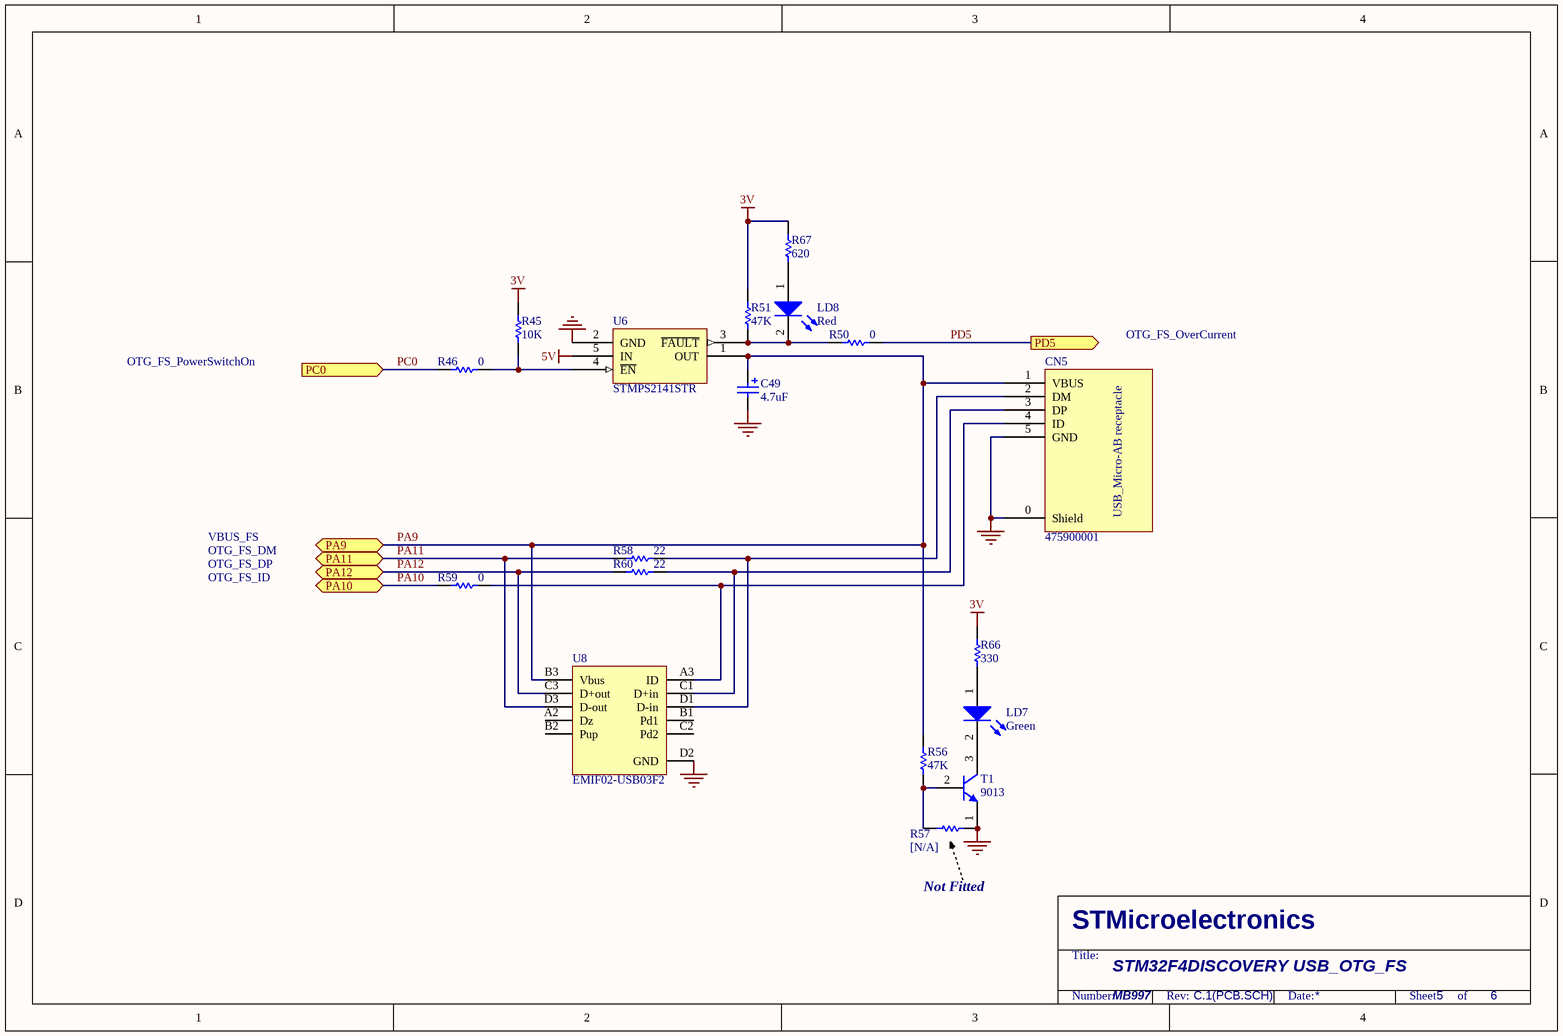
[diagram p5: USB_OTG_FS.SchDoc]

### Parts
C49  4.7uF  [TAN-A]
CN5  475900001  [USB-MICRO-AB]
LD7  Green  [0603D]
LD8  Red  [0603D]
R45  10K  [0402R]
R46  0  [0603R]
R50  0  [0603R]
R51  47K  [0402R]
R56  47K  [0402R]
R57  [N/A]  [0603R]
R58  22  [0603R]
R59  0  [0603R]
R60  22  [0603R]
R66  330  [0603R]
R67  620  [0603R]
T1  9013  [SOT-23]
U6  STMPS2141STR  [SOT23-5L]
U8  EMIF02-USB03F2  [Flip Chip]

### Ports
PA9 (bidir), PA10 (bidir), PA11 (bidir), PA12 (bidir), PC0 (in), PD5 (out)

### Nets
3V: R45.1 R51.1 R66.2 R67.2
5V: U6.5(IN)
GND: C49.2 CN5.0(Shield) CN5.5(GND) R57.1 T1.1(E) U6.2(GND) U8.D2(GND)
PA9: C49.1 CN5.1(VBUS) R56.2 U6.1(OUT) U8.B3(Vbus) ; port PA9
PA10: R59.2 ; port PA10
PA11: R58.2 U8.D3(D-out) ; port PA11
PA12: R60.2 U8.C3(D+out) ; port PA12
PC0: R46.2 ; port PC0
PD5: R50.1 ; port PD5
NetCN5_2: CN5.2(DM) R58.1 U8.D1(D-in)
NetCN5_3: CN5.3(DP) R60.1 U8.C1(D+in)
NetCN5_4: CN5.4(ID) R59.1 U8.A3(ID)
NetLD7_1: LD7.1(A) R66.1
NetLD7_2: LD7.2(K) T1.3(C)
NetLD8_1: LD8.1(A) R67.1
NetLD8_2: LD8.2(K) R50.2 R51.2 U6.3(~{FAULT})
NetR45_2: R45.2 R46.1 U6.4(~{EN})
NetR56_1: R56.1 R57.2 T1.2(B)

Not connected (* = marked no-connect by the designer): U8 A2(Dz) B1(Pd1) B2(Pup) C2(Pd2)

### Notes on the sheet
- OTG_FS_PowerSwitchOn
- OTG_FS_OverCurrent
- VBUS_FS
- OTG_FS_ID
- OTG_FS_DM
- OTG_FS_DP
- Not Fitted
- STM32F4DISCOVERY USB_OTG_FS
- MB997
- STMicroelectronics
- Title:
- Number:
- Rev:
- Date:
- Sheet       of
- (in symbol 475900001) USB_Micro-AB receptacle

### Library data of the parts
C49 = Cap Pol1: as C59 on sheet Audio; Published: 8-Jun-2000; Revision: July-2002: Re-released for DXP Platform.; Publisher: Altium Limited
LD7 LD8 = LED2: as LD3 on sheet IO Peripherals; Published: 8-Jun-2000; Revision: July-2002: Re-released for DXP Platform.; Publisher: Altium Limited
R45 R51 R56 R66 = res1: Resistor; Value: 1K; Published: 8-Jun-2000; Revision: July-2002: Re-released for DXP Platform.; Publisher: Altium Limited
R46 R50 R58-R60 R67 = Res1: Resistor; Value: 1K; Published: 8-Jun-2000; Revision: July-2002: Re-released for DXP Platform.; Publisher: Altium Limited
R57 = res1: Resistor; Value: 1K; Fitted: NO; Published: 8-Jun-2000; Revision: July-2002: Re-released for DXP Platform.; Publisher: Altium Limited
T1 = NPN: NPN Bipolar Transistor; Code - JEDEC: TO-226-AA; Published: 8-Jun-2000; Revision: July-2002: Re-released for DXP Platform.; Publisher: Altium Limited
U6 = STMPS2141STR: Enhanced single channel power switches; Manuf_1: STM; Provided: ST; Order: STMPS2141STR; Manuf_Part_1: STMPS2141STR
U8 = EMIF02-USB03F2: 2-line IPAD, EMI filter including ESD protection; Manuf_1: STM; Provided: ST; Order: EMIF02-USB03F2; Manuf_Part_1: EMIF02-USB03F2

## Nets that join several sheets
2V5: ST_LINK_V2 (C17.1 C18.2 U3.5), Audio (7 pins)
3V: MB997 (P2.5 P2.6), ST_LINK_V2 (18 pins), Audio (10 pins), IO Peripherals (C39.2 U5.1 U5.14 U5.15), USB_OTG_FS (R45.1 R51.1 R66.2 R67.2)
5V: MB997 (P2.3 P2.4), ST_LINK_V2 (9 pins), USB_OTG_FS (U6.5)
GND: MB997 (10 pins), ST_LINK_V2 (42 pins), Audio (29 pins), IO Peripherals (14 pins), STM32Fx (26 pins), USB_OTG_FS (7 pins)
VDD: MB997 (P1.3 P1.4 P2.22), ST_LINK_V2 (JP1.2 SB17.2), IO Peripherals (B1.1 B1.4 R37.2 R38.2), STM32Fx (21 pins)
BOOT0: MB997 (P2.21), STM32Fx (R30.2 R31.1 U4.94)
MCO: ST_LINK_V2 (C61.1 R68.2), STM32Fx (R25.1 SB13.1 U4.12)
NRST: MB997 (P1.6), ST_LINK_V2 (SB11.2), IO Peripherals (SB1.1), STM32Fx (U4.14)
PA0: MB997 (P1.12), IO Peripherals (SB20.1), STM32Fx (U4.23)
PA1: MB997 (P1.11), STM32Fx (U4.24)
PA2: MB997 (P1.14), STM32Fx (U4.25)
PA3: MB997 (P1.13), STM32Fx (U4.26)
PA4: MB997 (P1.16), Audio (R48.1 U7.40), STM32Fx (U4.29)
PA5: MB997 (P1.15), IO Peripherals (U5.4), STM32Fx (U4.30)
PA6: MB997 (P1.18), IO Peripherals (U5.7), STM32Fx (U4.31)
PA7: MB997 (P1.17), IO Peripherals (U5.6), STM32Fx (U4.32)
PA8: MB997 (P2.43), STM32Fx (U4.67)
PA9: MB997 (P2.44), STM32Fx (U4.68), USB_OTG_FS (5 pins)
PA10: MB997 (P2.41), STM32Fx (U4.69), USB_OTG_FS (R59.2)
PA11: STM32Fx (U4.70), USB_OTG_FS (R58.2 U8.D3)
PA12: STM32Fx (U4.71), USB_OTG_FS (R60.2 U8.C3)
PA13: MB997 (P2.42), ST_LINK_V2 (SB9.1), STM32Fx (U4.72)
PA14: MB997 (P2.39), ST_LINK_V2 (SB5.1), STM32Fx (U4.76)
PA15: MB997 (P2.40), STM32Fx (U4.77)
PB0: MB997 (P1.22), STM32Fx (U4.35)
PB1: MB997 (P1.21), STM32Fx (U4.36)
PB2: MB997 (P1.24), STM32Fx (R32.1 R34.2 U4.37)
PB3: MB997 (P2.28), ST_LINK_V2 (SB12.2), STM32Fx (U4.89)
PB4: MB997 (P2.25), STM32Fx (U4.90)
PB5: MB997 (P2.26), STM32Fx (U4.91)
PB6: MB997 (P2.23), Audio (U7.2), STM32Fx (R33.2 U4.92)
PB7: MB997 (P2.24), STM32Fx (U4.93)
PB8: MB997 (P2.19), STM32Fx (U4.95)
PB9: MB997 (P2.20), Audio (U7.1), STM32Fx (R29.2 U4.96)
PB10: MB997 (P1.34), Audio (U9.4), STM32Fx (U4.47)
PB11: MB997 (P1.35), STM32Fx (U4.48)
PB12: MB997 (P1.36), STM32Fx (U4.51)
PB13: MB997 (P1.37), STM32Fx (U4.52)
PB14: MB997 (P1.38), STM32Fx (U4.53)
PB15: MB997 (P1.39), STM32Fx (U4.54)
PC0: MB997 (P1.8), STM32Fx (U4.15), USB_OTG_FS (R46.2)
PC1: MB997 (P1.7), STM32Fx (U4.16)
PC2: MB997 (P1.10), STM32Fx (U4.17)
PC3: MB997 (P1.9), Audio (R55.1 U9.5), STM32Fx (U4.18)
PC4: MB997 (P1.20), Audio (R49.1), STM32Fx (U4.33)
PC5: MB997 (P1.19), STM32Fx (U4.34)
PC6: MB997 (P2.47), STM32Fx (U4.63)
PC7: MB997 (P2.48), Audio (U7.37), STM32Fx (U4.64)
PC8: MB997 (P2.45), STM32Fx (U4.65)
PC9: MB997 (P2.46), STM32Fx (U4.66)
PC10: MB997 (P2.37), Audio (U7.38), STM32Fx (U4.78)
PC11: MB997 (P2.38), STM32Fx (U4.79)
PC12: MB997 (P2.35), Audio (U7.39), STM32Fx (U4.80)
PC13: MB997 (P2.12), STM32Fx (U4.7)
PC14: MB997 (P2.9), STM32Fx (SB16.2)
PC15: MB997 (P2.10), STM32Fx (SB15.2)
PD0: MB997 (P2.36), STM32Fx (U4.81)
PD1: MB997 (P2.33), STM32Fx (U4.82)
PD2: MB997 (P2.34), STM32Fx (U4.83)
PD3: MB997 (P2.31), STM32Fx (U4.84)
PD4: MB997 (P2.32), Audio (R43.1 U7.32), STM32Fx (U4.85)
PD5: MB997 (P2.29), STM32Fx (U4.86), USB_OTG_FS (R50.1)
PD6: MB997 (P2.30), STM32Fx (U4.87)
PD7: MB997 (P2.27), STM32Fx (U4.88)
PD8: MB997 (P1.40), STM32Fx (U4.55)
PD9: MB997 (P1.41), STM32Fx (U4.56)
PD10: MB997 (P1.42), STM32Fx (U4.57)
PD11: MB997 (P1.43), STM32Fx (U4.58)
PD12: MB997 (P1.44), IO Peripherals (R40.2), STM32Fx (U4.59)
PD13: MB997 (P1.45), IO Peripherals (R36.2), STM32Fx (U4.60)
PD14: MB997 (P1.46), IO Peripherals (R41.2), STM32Fx (U4.61)
PD15: MB997 (P1.47), IO Peripherals (R42.2), STM32Fx (U4.62)
PE0: MB997 (P2.17), IO Peripherals (U5.11), STM32Fx (U4.97)
PE1: MB997 (P2.18), IO Peripherals (U5.9), STM32Fx (U4.98)
PE2: MB997 (P2.15), STM32Fx (U4.1)
PE3: MB997 (P2.16), IO Peripherals (U5.8), STM32Fx (U4.2)
PE4: MB997 (P2.13), STM32Fx (U4.3)
PE5: MB997 (P2.14), STM32Fx (U4.4)
PE6: MB997 (P2.11), STM32Fx (U4.5)
PE7: MB997 (P1.25), STM32Fx (U4.38)
PE8: MB997 (P1.26), STM32Fx (U4.39)
PE9: MB997 (P1.27), STM32Fx (U4.40)
PE10: MB997 (P1.28), STM32Fx (U4.41)
PE11: MB997 (P1.29), STM32Fx (U4.42)
PE12: MB997 (P1.30), STM32Fx (U4.43)
PE13: MB997 (P1.31), STM32Fx (U4.44)
PE14: MB997 (P1.32), STM32Fx (U4.45)
PE15: MB997 (P1.33), STM32Fx (U4.46)
PH0: MB997 (P2.7), STM32Fx (SB13.2)
PH1: MB997 (P2.8), STM32Fx (SB14.2)